# Altium schematic sheet PROC054D_System_Power.SchDoc: System Power
size 558 x 431 mm; Date: Not shown in title block; ApprovedBy: Not shown in title block; CheckedBy: Not shown in title block; Author: Not shown in title block; CompanyName: Not shown in title block; DrawnBy: a0271760; Engineer: Not shown in title block; Organization: Not shown in title block; Address1: Not shown in title block; Address2: Not shown in title block; Address3: Not shown in title block; Address4: Not shown in title block; DocumentNumber: 3; Revision: Use project pAWRameter SCH_Rev; SheetNumber: 3; SheetTotal: 19; PageSetup: Record=PageOptions|CenterHorizontal=True|CenterVertical=True|PrintScale=1.00|XCorrection=1.00|YCorrection=1.00|PrintKind=0|BorderSize=5000000|LeftOffset=0|BottomOffset=0|Orientation=2|PaperLength=1000|PaperWidth=1000|Scale=100|PaperSource=15|PrintQuality=600|MediaType=1|DitherType=10|PaperKind=Letter|PrintScaleMode=1; CurrentTime: Not shown in title block; CurrentDate: Not shown in title block; Time: Not shown in title block; DocumentFullPathAndName: Not shown in title block; DocumentName: Not shown in title block; ModifiedDate: Not shown in title block; ImagePath: Not shown in title block
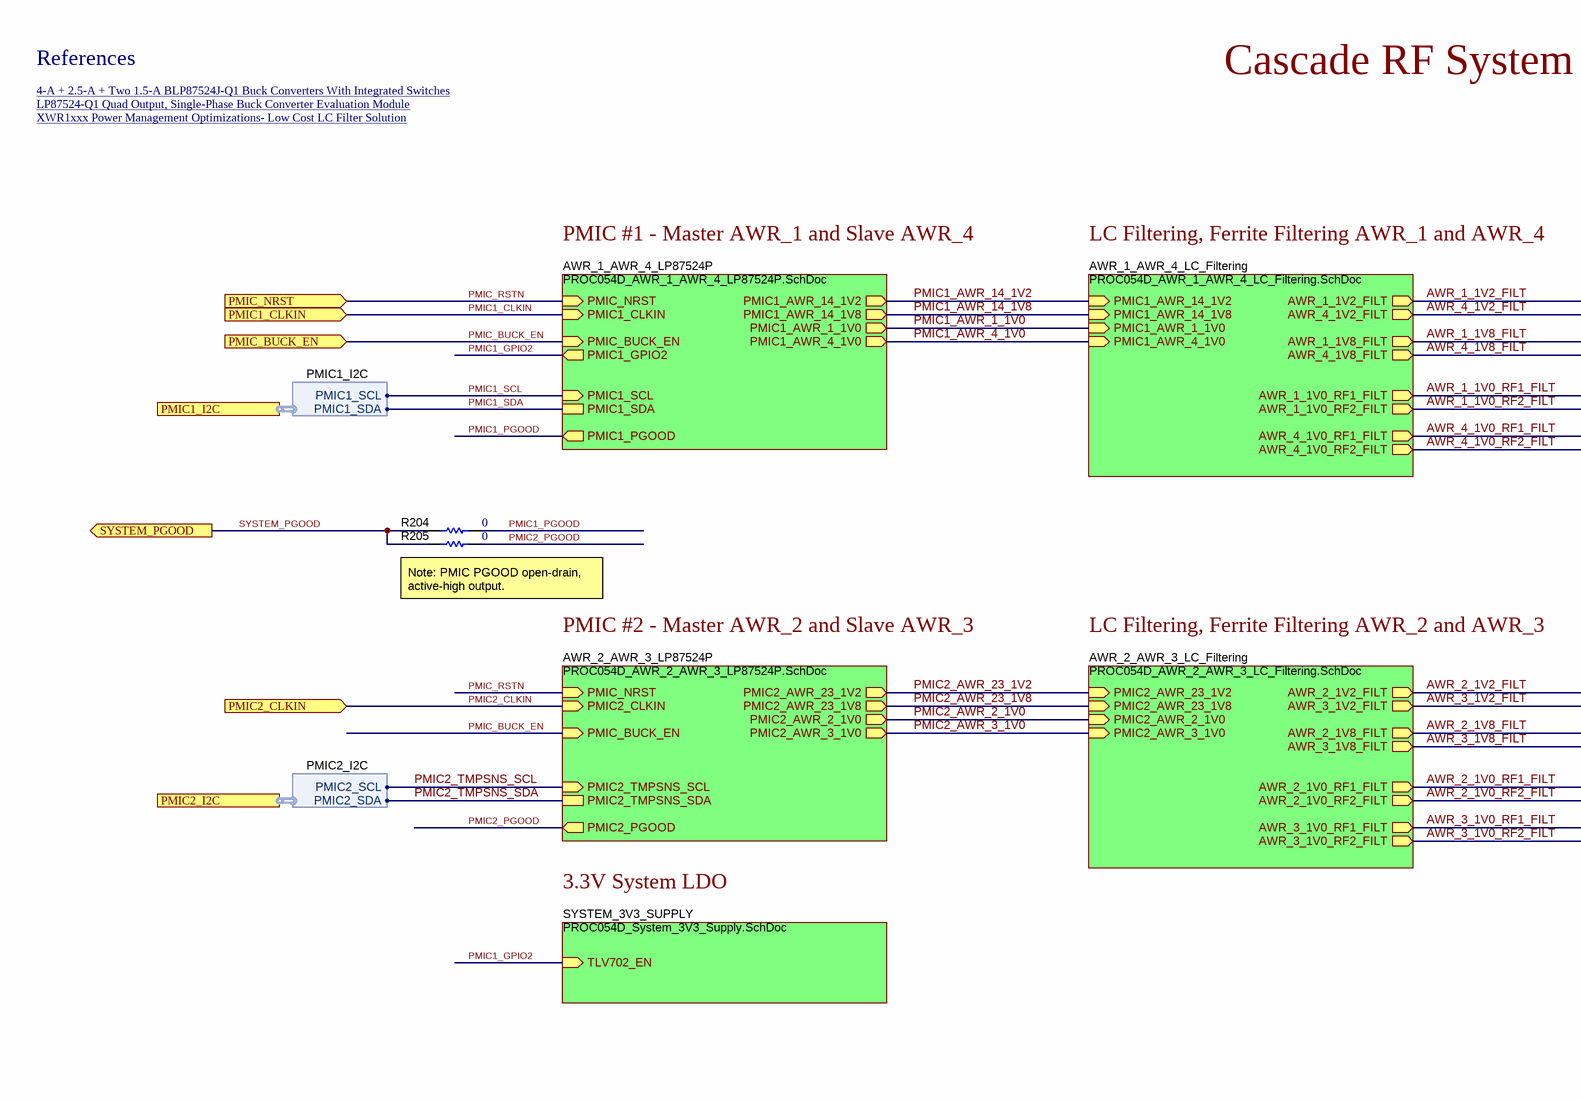
[diagram p0: PROC054D_System_Power.SchDoc, top left]
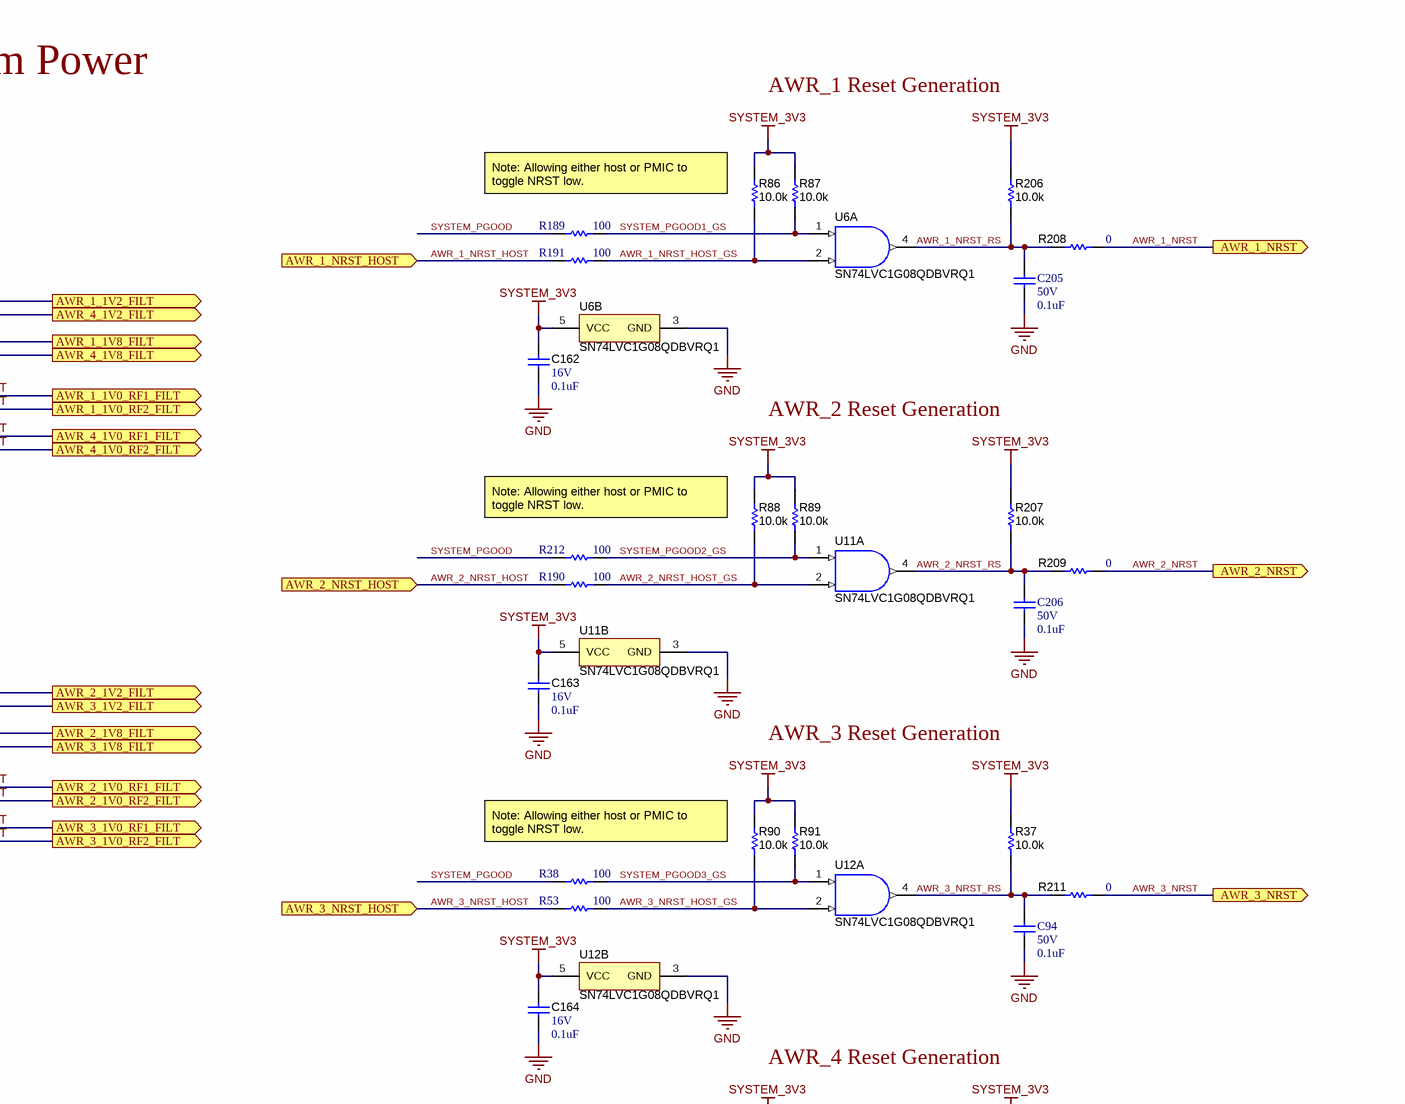
[diagram p1: PROC054D_System_Power.SchDoc, top right]
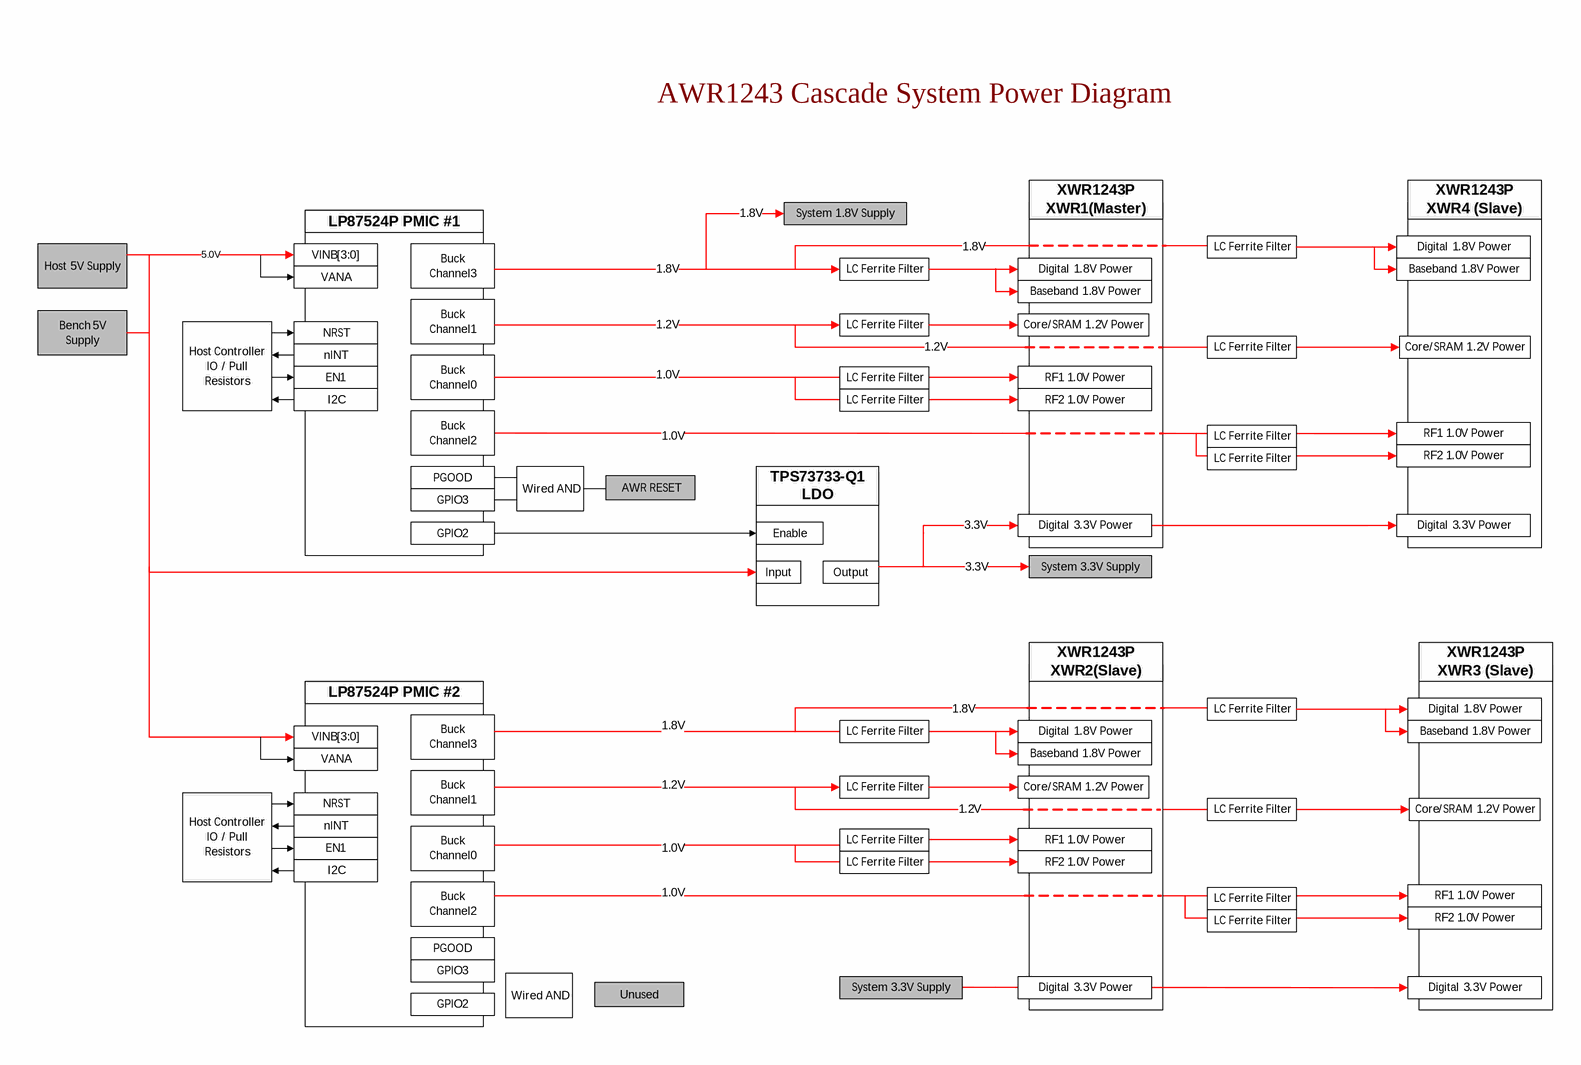
[diagram p2: PROC054D_System_Power.SchDoc, bottom left]
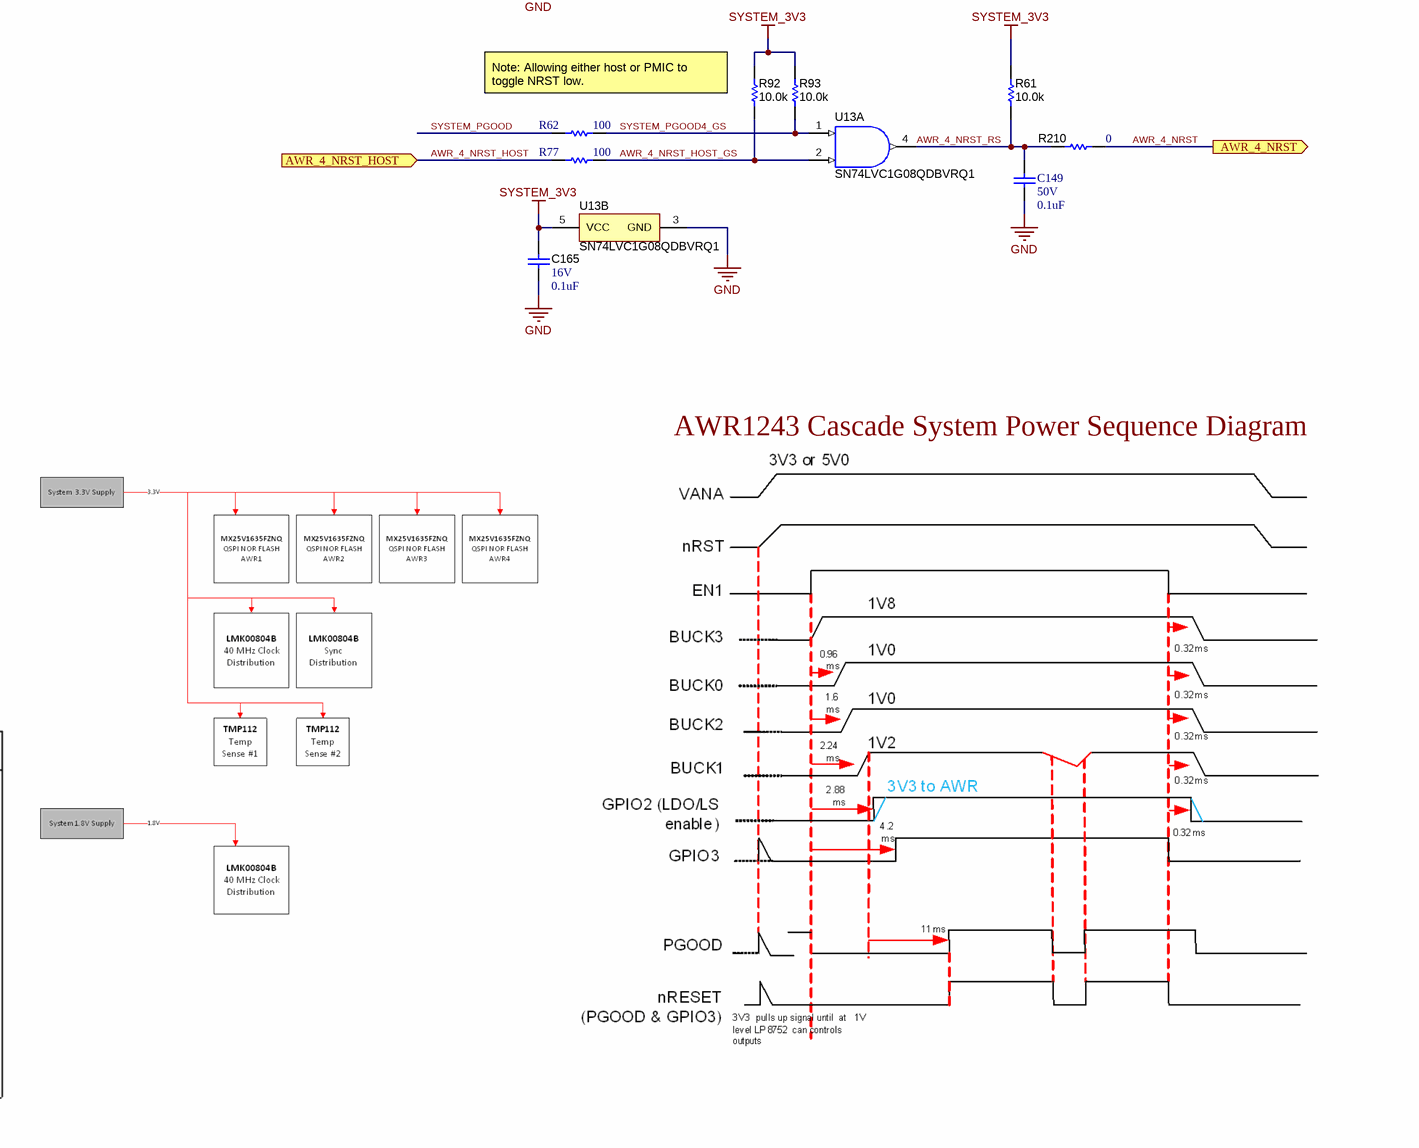
[diagram p3: PROC054D_System_Power.SchDoc, bottom right]

## Parts
C94  VDC_V: 50V  ValueDisplayed: 0.1uF  [0402]  (hidden comment: CGA2B3X7R1H104K050BB)
C149  VDC_V: 50V  ValueDisplayed: 0.1uF  [0402]  (hidden comment: CGA2B3X7R1H104K050BB)
C162  VDC_V: 16V  ValueDisplayed: 0.1uF  [0402]  (hidden comment: GCM155R71C104KA55D)
C163  VDC_V: 16V  ValueDisplayed: 0.1uF  [0402]  (hidden comment: GCM155R71C104KA55D)
C164  VDC_V: 16V  ValueDisplayed: 0.1uF  [0402]  (hidden comment: GCM155R71C104KA55D)
C165  VDC_V: 16V  ValueDisplayed: 0.1uF  [0402]  (hidden comment: GCM155R71C104KA55D)
C205  VDC_V: 50V  ValueDisplayed: 0.1uF  [0402]  (hidden comment: CGA2B3X7R1H104K050BB)
C206  VDC_V: 50V  ValueDisplayed: 0.1uF  [0402]  (hidden comment: CGA2B3X7R1H104K050BB)
R37  ValueDisplayed: 10.0k  [0402]  (hidden comment: CRCW040210K0FKED)
R38  ValueDisplayed: 100  [0402]  (hidden comment: MCS0402MD1000BE100)
R53  ValueDisplayed: 100  [0402]  (hidden comment: MCS0402MD1000BE100)
R61  ValueDisplayed: 10.0k  [0402]  (hidden comment: CRCW040210K0FKED)
R62  ValueDisplayed: 100  [0402]  (hidden comment: MCS0402MD1000BE100)
R77  ValueDisplayed: 100  [0402]  (hidden comment: MCS0402MD1000BE100)
R86  ValueDisplayed: 10.0k  [0402]  (hidden comment: CRCW040210K0FKED)
R87  ValueDisplayed: 10.0k  [0402]  (hidden comment: CRCW040210K0FKED)
R88  ValueDisplayed: 10.0k  [0402]  (hidden comment: CRCW040210K0FKED)
R89  ValueDisplayed: 10.0k  [0402]  (hidden comment: CRCW040210K0FKED)
R90  ValueDisplayed: 10.0k  [0402]  (hidden comment: CRCW040210K0FKED)
R91  ValueDisplayed: 10.0k  [0402]  (hidden comment: CRCW040210K0FKED)
R92  ValueDisplayed: 10.0k  [0402]  (hidden comment: CRCW040210K0FKED)
R93  ValueDisplayed: 10.0k  [0402]  (hidden comment: CRCW040210K0FKED)
R189  ValueDisplayed: 100  [0402]  (hidden comment: MCS0402MD1000BE100)
R190  ValueDisplayed: 100  [0402]  (hidden comment: MCS0402MD1000BE100)
R191  ValueDisplayed: 100  [0402]  (hidden comment: MCS0402MD1000BE100)
R204  ValueDisplayed: 0  [0402]  (hidden comment: ERJ-2GE0R00X)
R205  ValueDisplayed: 0  [0402]  (hidden comment: ERJ-2GE0R00X)
R206  ValueDisplayed: 10.0k  [0402]  (hidden comment: CRCW040210K0FKED)
R207  ValueDisplayed: 10.0k  [0402]  (hidden comment: CRCW040210K0FKED)
R208  ValueDisplayed: 0  [0402]  (hidden comment: ERJ-2GE0R00X)
R209  ValueDisplayed: 0  [0402]  (hidden comment: ERJ-2GE0R00X)
R210  ValueDisplayed: 0  [0402]  (hidden comment: ERJ-2GE0R00X)
R211  ValueDisplayed: 0  [0402]  (hidden comment: ERJ-2GE0R00X)
R212  ValueDisplayed: 100  [0402]  (hidden comment: MCS0402MD1000BE100)
U6  SN74LVC1G08QDBVRQ1  [DBV0005A_N]  (parts A,B of 2)
U11  SN74LVC1G08QDBVRQ1  [DBV0005A_N]  (parts A,B of 2)
U12  SN74LVC1G08QDBVRQ1  [DBV0005A_N]  (parts A,B of 2)
U13  SN74LVC1G08QDBVRQ1  [DBV0005A_N]  (parts A,B of 2)

## Sub-sheets
AWR_1_AWR_4_LC_Filtering = PROC054D_AWR_1_AWR_4_LC_Filtering.SchDoc: PMIC1_AWR_4_1V0 (in), PMIC1_AWR_1_1V0 (in), PMIC1_AWR_14_1V8 (in), PMIC1_AWR_14_1V2 (in), AWR_1_1V2_FILT (out), AWR_4_1V2_FILT (out), AWR_1_1V0_RF1_FILT (out), AWR_4_1V0_RF1_FILT (out), AWR_4_1V0_RF2_FILT (out), AWR_1_1V0_RF2_FILT (out), AWR_1_1V8_FILT (out), AWR_4_1V8_FILT (out)
AWR_1_AWR_4_LP87524P = PROC054D_AWR_1_AWR_4_LP87524P.SchDoc: PMIC_NRST (in), PMIC1_CLKIN (in), PMIC_BUCK_EN (in), PMIC1_SCL (in), PMIC1_SDA, PMIC1_PGOOD (out), PMIC1_GPIO2 (out), PMIC1_AWR_1_1V0 (out), PMIC1_AWR_14_1V8 (out), PMIC1_AWR_4_1V0 (out), PMIC1_AWR_14_1V2 (out)
AWR_2_AWR_3_LC_Filtering = PROC054D_AWR_2_AWR_3_LC_Filtering.SchDoc: AWR_2_1V2_FILT (out), PMIC2_AWR_3_1V0 (in), PMIC2_AWR_2_1V0 (in), PMIC2_AWR_23_1V8 (in), PMIC2_AWR_23_1V2 (in), AWR_3_1V2_FILT (out), AWR_3_1V0_RF1_FILT (out), AWR_3_1V0_RF2_FILT (out), AWR_2_1V0_RF1_FILT (out), AWR_2_1V0_RF2_FILT (out), AWR_2_1V8_FILT (out), AWR_3_1V8_FILT (out)
AWR_2_AWR_3_LP87524P = PROC054D_AWR_2_AWR_3_LP87524P.SchDoc: PMIC_NRST (in), PMIC2_CLKIN (in), PMIC_BUCK_EN (in), PMIC2_TMPSNS_SCL (in), PMIC2_TMPSNS_SDA, PMIC2_PGOOD (out), PMIC2_AWR_3_1V0 (out), PMIC2_AWR_23_1V8 (out), PMIC2_AWR_2_1V0 (out), PMIC2_AWR_23_1V2 (out)
SYSTEM_3V3_SUPPLY = PROC054D_System_3V3_Supply.SchDoc: TLV702_EN (in)

## Ports
AWR_1_1V0_RF1_FILT (out), AWR_1_1V0_RF2_FILT (out), AWR_1_1V2_FILT (out), AWR_1_1V8_FILT (out), AWR_1_NRST (out), AWR_1_NRST_HOST (in), AWR_2_1V0_RF1_FILT (out), AWR_2_1V0_RF2_FILT (out), AWR_2_1V2_FILT (out), AWR_2_1V8_FILT (out), AWR_2_NRST (out), AWR_2_NRST_HOST (in), AWR_3_1V0_RF1_FILT (out), AWR_3_1V0_RF2_FILT (out), AWR_3_1V2_FILT (out), AWR_3_1V8_FILT (out), AWR_3_NRST (out), AWR_3_NRST_HOST (in), AWR_4_1V0_RF1_FILT (out), AWR_4_1V0_RF2_FILT (out), AWR_4_1V2_FILT (out), AWR_4_1V8_FILT (out), AWR_4_NRST (out), AWR_4_NRST_HOST (in), PMIC1_CLKIN (in), PMIC1_I2C (harness PMIC1_I2C), PMIC2_CLKIN (in), PMIC2_I2C (harness PMIC2_I2C), PMIC_BUCK_EN (in), PMIC_NRST (in), SYSTEM_PGOOD (out)

## Harnesses
PMIC2_I2C: PMIC2_SCL, PMIC2_SDA
PMIC1_I2C: PMIC1_SCL, PMIC1_SDA

## Nets
GND: C94.2 C149.2 C162.2 C163.2 C164.2 C165.2 C205.2 C206.2 U6.3(GND) U11.3(GND) U12.3(GND) U13.3(GND)
SYSTEM_3V3: C162.1 C163.1 C164.1 C165.1 R37.2 R61.2 R86.2 R87.2 R88.2 R89.2 R90.2 R91.2 R92.2 R93.2 R206.2 R207.2 U6.5(VCC) U11.5(VCC) U12.5(VCC) U13.5(VCC)
AWR_1_1V0_RF1_FILT: port AWR_1_1V0_RF1_FILT, sheet AWR_1_AWR_4_LC_Filtering/AWR_1_1V0_RF1_FILT
AWR_1_1V0_RF2_FILT: port AWR_1_1V0_RF2_FILT, sheet AWR_1_AWR_4_LC_Filtering/AWR_1_1V0_RF2_FILT
AWR_1_1V2_FILT: port AWR_1_1V2_FILT, sheet AWR_1_AWR_4_LC_Filtering/AWR_1_1V2_FILT
AWR_1_1V8_FILT: port AWR_1_1V8_FILT, sheet AWR_1_AWR_4_LC_Filtering/AWR_1_1V8_FILT
AWR_1_NRST: R208.2 ; port AWR_1_NRST
AWR_1_NRST_HOST: R191.1 ; port AWR_1_NRST_HOST
AWR_1_NRST_HOST_GS: R86.1 R191.2 U6.2(B)
AWR_1_NRST_RS: C205.1 R206.1 R208.1 U6.4(Y)
AWR_2_1V0_RF1_FILT: port AWR_2_1V0_RF1_FILT, sheet AWR_2_AWR_3_LC_Filtering/AWR_2_1V0_RF1_FILT
AWR_2_1V0_RF2_FILT: port AWR_2_1V0_RF2_FILT, sheet AWR_2_AWR_3_LC_Filtering/AWR_2_1V0_RF2_FILT
AWR_2_1V2_FILT: port AWR_2_1V2_FILT, sheet AWR_2_AWR_3_LC_Filtering/AWR_2_1V2_FILT
AWR_2_1V8_FILT: port AWR_2_1V8_FILT, sheet AWR_2_AWR_3_LC_Filtering/AWR_2_1V8_FILT
AWR_2_NRST: R209.2 ; port AWR_2_NRST
AWR_2_NRST_HOST: R190.1 ; port AWR_2_NRST_HOST
AWR_2_NRST_HOST_GS: R88.1 R190.2 U11.2(B)
AWR_2_NRST_RS: C206.1 R207.1 R209.1 U11.4(Y)
AWR_3_1V0_RF1_FILT: port AWR_3_1V0_RF1_FILT, sheet AWR_2_AWR_3_LC_Filtering/AWR_3_1V0_RF1_FILT
AWR_3_1V0_RF2_FILT: port AWR_3_1V0_RF2_FILT, sheet AWR_2_AWR_3_LC_Filtering/AWR_3_1V0_RF2_FILT
AWR_3_1V2_FILT: port AWR_3_1V2_FILT, sheet AWR_2_AWR_3_LC_Filtering/AWR_3_1V2_FILT
AWR_3_1V8_FILT: port AWR_3_1V8_FILT, sheet AWR_2_AWR_3_LC_Filtering/AWR_3_1V8_FILT
AWR_3_NRST: R211.2 ; port AWR_3_NRST
AWR_3_NRST_HOST: R53.1 ; port AWR_3_NRST_HOST
AWR_3_NRST_HOST_GS: R53.2 R90.1 U12.2(B)
AWR_3_NRST_RS: C94.1 R37.1 R211.1 U12.4(Y)
AWR_4_1V0_RF1_FILT: port AWR_4_1V0_RF1_FILT, sheet AWR_1_AWR_4_LC_Filtering/AWR_4_1V0_RF1_FILT
AWR_4_1V0_RF2_FILT: port AWR_4_1V0_RF2_FILT, sheet AWR_1_AWR_4_LC_Filtering/AWR_4_1V0_RF2_FILT
AWR_4_1V2_FILT: port AWR_4_1V2_FILT, sheet AWR_1_AWR_4_LC_Filtering/AWR_4_1V2_FILT
AWR_4_1V8_FILT: port AWR_4_1V8_FILT, sheet AWR_1_AWR_4_LC_Filtering/AWR_4_1V8_FILT
AWR_4_NRST: R210.2 ; port AWR_4_NRST
AWR_4_NRST_HOST: R77.1 ; port AWR_4_NRST_HOST
AWR_4_NRST_HOST_GS: R77.2 R92.1 U13.2(B)
AWR_4_NRST_RS: C149.1 R61.1 R210.1 U13.4(Y)
PMIC1_AWR_1_1V0: sheet AWR_1_AWR_4_LP87524P/PMIC1_AWR_1_1V0, sheet AWR_1_AWR_4_LC_Filtering/PMIC1_AWR_1_1V0
PMIC1_AWR_4_1V0: sheet AWR_1_AWR_4_LP87524P/PMIC1_AWR_4_1V0, sheet AWR_1_AWR_4_LC_Filtering/PMIC1_AWR_4_1V0
PMIC1_AWR_14_1V2: sheet AWR_1_AWR_4_LP87524P/PMIC1_AWR_14_1V2, sheet AWR_1_AWR_4_LC_Filtering/PMIC1_AWR_14_1V2
PMIC1_AWR_14_1V8: sheet AWR_1_AWR_4_LP87524P/PMIC1_AWR_14_1V8, sheet AWR_1_AWR_4_LC_Filtering/PMIC1_AWR_14_1V8
PMIC1_CLKIN: port PMIC1_CLKIN, sheet AWR_1_AWR_4_LP87524P/PMIC1_CLKIN
PMIC1_GPIO2: sheet AWR_1_AWR_4_LP87524P/PMIC1_GPIO2, sheet SYSTEM_3V3_SUPPLY/TLV702_EN
PMIC1_PGOOD: R204.2 ; sheet AWR_1_AWR_4_LP87524P/PMIC1_PGOOD
PMIC1_SCL: sheet AWR_1_AWR_4_LP87524P/PMIC1_SCL, port PMIC1_I2C.PMIC1_SCL
PMIC1_SDA: sheet AWR_1_AWR_4_LP87524P/PMIC1_SDA, port PMIC1_I2C.PMIC1_SDA
PMIC2_AWR_2_1V0: sheet AWR_2_AWR_3_LP87524P/PMIC2_AWR_2_1V0, sheet AWR_2_AWR_3_LC_Filtering/PMIC2_AWR_2_1V0
PMIC2_AWR_3_1V0: sheet AWR_2_AWR_3_LP87524P/PMIC2_AWR_3_1V0, sheet AWR_2_AWR_3_LC_Filtering/PMIC2_AWR_3_1V0
PMIC2_AWR_23_1V2: sheet AWR_2_AWR_3_LP87524P/PMIC2_AWR_23_1V2, sheet AWR_2_AWR_3_LC_Filtering/PMIC2_AWR_23_1V2
PMIC2_AWR_23_1V8: sheet AWR_2_AWR_3_LP87524P/PMIC2_AWR_23_1V8, sheet AWR_2_AWR_3_LC_Filtering/PMIC2_AWR_23_1V8
PMIC2_CLKIN: port PMIC2_CLKIN, sheet AWR_2_AWR_3_LP87524P/PMIC2_CLKIN
PMIC2_PGOOD: R205.2 ; sheet AWR_2_AWR_3_LP87524P/PMIC2_PGOOD
PMIC2_TMPSNS_SCL: sheet AWR_2_AWR_3_LP87524P/PMIC2_TMPSNS_SCL, port PMIC2_I2C.PMIC2_SCL
PMIC2_TMPSNS_SDA: sheet AWR_2_AWR_3_LP87524P/PMIC2_TMPSNS_SDA, port PMIC2_I2C.PMIC2_SDA
PMIC_BUCK_EN: port PMIC_BUCK_EN, sheet AWR_1_AWR_4_LP87524P/PMIC_BUCK_EN, sheet AWR_2_AWR_3_LP87524P/PMIC_BUCK_EN
PMIC_RSTN: port PMIC_NRST, sheet AWR_1_AWR_4_LP87524P/PMIC_NRST, sheet AWR_2_AWR_3_LP87524P/PMIC_NRST
SYSTEM_PGOOD: R38.1 R62.1 R189.1 R204.1 R205.1 R212.1 ; port SYSTEM_PGOOD
SYSTEM_PGOOD1_GS: R87.1 R189.2 U6.1(A)
SYSTEM_PGOOD2_GS: R89.1 R212.2 U11.1(A)
SYSTEM_PGOOD3_GS: R38.2 R91.1 U12.1(A)
SYSTEM_PGOOD4_GS: R62.2 R93.1 U13.1(A)

## Notes on the sheet
- References
- Cascade RF System Power
- LP87524-Q1 Quad Output, Single-Phase Buck Converter Evaluation Module <http://www.ti.com/tool/lp87524q1evm>
- 4-A + 2.5-A + Two 1.5-A BLP87524J-Q1 Buck Converters With Integrated Switches <http://www.ti.com/product/lp87524j-q1>
- XWR1xxx Power Management Optimizations- Low Cost LC Filter Solution <http://www.ti.com/lit/pdf/swra577>
- AWR_1 Reset Generation
- Note: Allowing either host or PMIC to toggle NRST low.
- PMIC #1 - Master AWR_1 and Slave AWR_4
- LC Filtering, Ferrite Filtering AWR_1 and AWR_4
- AWR_2 Reset Generation
- (near R205) Note: PMIC PGOOD open-drain, active-high output.
- PMIC #2 - Master AWR_2 and Slave AWR_3
- LC Filtering, Ferrite Filtering AWR_2 and AWR_3
- AWR_3 Reset Generation
- 3.3V System LDO
- AWR_4 Reset Generation
- AWR1243 Cascade System Power Diagram
- AWR1243 Cascade System Power Sequence Diagram
- Drawn By:
- SVN Rev:
- Number:
- TID #:
- Orderable:
- Rev:
- Sheet Title:
- File:
- Project Title:
- Designed for:
- Assembly VAWRiant:
- Mod. Date:
- Sheet:
- Size:
- of
- C
- http://www.ti.com
- Texas Instruments and/or its licensors do not wAWRrant the accuracy or completeness of this specification or any information contained therein. Texas Instruments and/or its licensors do not wAWRrant that this design will meet the specifications, will be suitable for your application or fit for any pAWRticulAWR purpose, or will operate in an implementation. Texas Instruments and/or its licensors do not wAWRrant that the design is production worthy. You should completely validate and test your design implementation to confirm the system functionality for your application.
- Engineer:
- Contact:
- © Texas Instruments

## Library data of the parts
C94 C149 C205 C206 = CMP-0006325-2: CAP, CERM, 0.1 uF, 50 V, +/- 10%, X7R, AEC-Q200 Grade 1, 0402; Manufacturer: TDK; TaMin_C: -55°C; ESR_ohm: 0.039064; Polarized: N; SizeAreaWB_mm2: 3; Value1: 0.039064 ohm; U/M: EA; Value: 0.1uF; TaMax_C: 125°C; SizeZ_mm: 0.6; SizeX_mm: 1; SizeY_mm: 0.5; AEC Qualified: Y; Cap_F: 100nF; IRMS_A: 8.14669dA; AEC Category: Q200; Supplier Part Number 2: 04X3148; Publisher: Texas Instruments; Supplier 2: Newark; Supplier Part Number 3: 810-CGA2B3X7R1H104K; TempCo: X7R; Supplier 3: Mouser; Published: 2008-06-19; RoHS: Y; MountType: SMT; Supplier 1: Digi-Key; PackageReference: 0402; Tolerance_%: 10%; Cap_Case: 0402; Value2: 50V; SizeArea_mm2: 0.5; CompType: Capacitor; LatestRevisionDate: 2017-03-09; PartNumber: CGA2B3X7R1H104K050BB; ComponentLink1Description: Datasheet link; AEC Grade: 1; Supplier Part Number 1: 445-6899-1-ND; Technology: Ceramic; ComponentLink1URL: https://product.tdk.com/en/search/capacitor/ceramic/mlcc/info?part_no=CGA2B3X7R1H104K050BB
C162-C165 = CMP-0006351-2: CAP, CERM, 0.1 uF, 16 V, +/- 10%, X7R, 0402; Manufacturer: MuRata; TaMin_C: -55°C; Polarized: N; SizeAreaWB_mm2: 3; Value1: Unknown; U/M: EA; Value: 0.1uF; TaMax_C: 125°C; SizeZ_mm: 0.6; SizeX_mm: 1; SizeY_mm: 0.5; Cap_F: 100nF; AEC Category: Q200; Publisher: Texas Instruments; TempCo: X7R; Published: 2008-06-19; RoHS: Y; MountType: SMT; Supplier 1: Digi-Key; PackageReference: 0402; Tolerance_%: 10%; Cap_Case: 0402; Value2: 16V; SizeArea_mm2: 0.5; CompType: Capacitor; LatestRevisionDate: 2017-03-09; PartNumber: GCM155R71C104KA55D; AEC Qualified: ?; ComponentLink1Description: Datasheet link; Supplier Part Number 1: 490-4759-2-ND; Technology: Ceramic; ComponentLink1URL: http://psearch.murata.com/capacitor/product/GCM155R71C104KA55%23.pdf
R37 R61 R86-R93 R206 R207 = CMP-0025958-3: RES, 10.0 k, 1%, 0.063 W, AEC-Q200 Grade 0, 0402; Manufacturer: Vishay-Dale; Power_W: 63mW; TempCo: 100 ppm/C; Value_Code: 10k0; Value: 10.0k; EIA_Code: E96; Res_ohm: 10k; SizeX_mm: 1; SizeY_mm: 0.5; SizeZ_mm: 0.6; Value2: 0.063W; AEC Qualified: Y; VDC_V: 50V; AEC Category: Q200; AEC Grade: 0; Supplier Part Number 2: 52K6595; Supplier 2: Newark; Supplier Part Number 3: 71-CRCW0402-10K-E3; Supplier 3: Mouser; RoHS: E; Value1: 1%; MountType: SMT; Supplier 1: Digi-Key; PackageReference: 0402; Tolerance_%: 1%; SizeArea_mm2: 0.5; CompType: Resistor; PartNumber: CRCW040210K0FKED; ComponentLink1Description: Datasheet link; Supplier Part Number 1: 541-10.0KLCT-ND; Technology: Thick Film; ComponentLink1URL: http://www.vishay.com/docs/20035/dcrcwe3.pdf
R38 R53 R62 R77 R189-R191 R212 = CMP-0026794-1: RES, 100, 0.1%, 0.1 W, AEC-Q200 Grade 0, 0402; Manufacturer: Vishay/Beyschlag; Power_W: 100mW; TempCo: 25 ppm/C; Value_Code: 100R; U/M: EA; Value: 100; EIA_Code: E192; SizeX_mm: 1; SizeY_mm: 0.5; SizeZ_mm: 0.6; Value2: 0.1W; AEC Qualified: Y; VDC_V: 50V; AEC Grade: 0; AEC Category: Q200; ComponentLink1URL: http://www.vishay.com/docs/28785/mcat_pre.pdf; Supplier Part Number 2: 01Y6988; Publisher: Texas Instruments; Supplier 2: Newark; Supplier Part Number 3: 594-MCS0402MD1000BE1; Supplier 3: Mouser; Published: 2008-06-26; RoHS: Y; Value1: 0.1%; MountType: SMT; Supplier 1: Digi-Key; PackageReference: 0402; Tolerance_%: 0.1%; Res_ohm: 100; SizeArea_mm2: 0.5; CompType: Resistor; LatestRevisionDate: 2017-03-09; PartNumber: MCS0402MD1000BE100; ComponentLink1Description: Datasheet link; Supplier Part Number 1: MCS0402-100-MBCT-ND; Technology: Thin Film
R204 R205 R208-R211 = CMP-0026992-3: RES, 0, 5%, 0.1 W, AEC-Q200 Grade 0, 0402; Manufacturer: Panasonic; Power_W: 100mW; TempCo: 600 ppm/C; Value_Code: 0000; Value: 0; EIA_Code: E24; SizeX_mm: 1; SizeY_mm: 0.5; SizeZ_mm: 0.6; Value2: 0.1W; AEC Qualified: Y; VDC_V: 50V; AEC Category: Q200; SizeAreaWB_mm2: 3; Supplier Part Number 2: 65T8307; Supplier 2: Newark; Supplier Part Number 3: 667-ERJ-2GE0R00X; Supplier 3: Mouser; RoHS: Y; Value1: 5%; MountType: SMT; Supplier 1: Digi-Key; PackageReference: 0402; Tolerance_%: 5%; Res_ohm: 0; SizeArea_mm2: 0.5; CompType: Resistor; PartNumber: ERJ-2GE0R00X; ComponentLink1Description: Datasheet link; Supplier Part Number 1: P0.0JCT-ND; Technology: Thick Film; ComponentLink1URL: https://industrial.panasonic.com/cdbs/www-data/pdf/RDA0000/AOA0000C301.pdf; AEC Grade: 0
U6 U11-U13 = CMP-0051570-2: Automotive Catalog Single 2-Input Positive-AND Gate, DBV0005A, LARGE T&R; Manufacturer: Texas Instruments; Generic Part Number: SN74LVC1G08-Q1; VCC(Min)(V): 1.65; Gate Type: AND; 3-State Output: No; tpd @ Nom Voltage(Max)(ns): 8,5.5,4.5,4; Logic: True; Voltage(Nom)(V): 1.8,2.5,3.3,5; ICC @ Nom Voltage(Max)(mA): 0.01; Input Type: CMOS/TTL; Output Type: CMOS; Output Drive (IOL/IOH)(Max)(mA): 32/-32; Bits(#): 1; Technology Family: LVC; F @ Nom Voltage(Max)(Mhz): 150; VCC(Max)(V): 5.5; AEC Category: Q200; AEC Qualified: Y; CompType: IC; Sub-Family: AND Gate; PackageReference: DBV0005A; DatasheetVersion: SCES556F; Operating Temperature Range(C): -40 to 125,-40 to 85; Schmitt Trigger: No; Rating: Automotive; Alternate Manufacturer: Texas Instruments; ComponentLink1Description: Datasheet Link; ComponentLink1URL: http://www.ti.com/lit/ds/symlink/SN74LVC1G08-Q1.pdf; ComponentLink2Description: Product Folder; ComponentLink2URL: http://www.ti.com/product/SN74LVC1G08-Q1; MountType: SMT; PackageDescription: SOT-23-5; PartNumber: SN74LVC1G08QDBVRQ1; RoHS: Y; PartId: 1